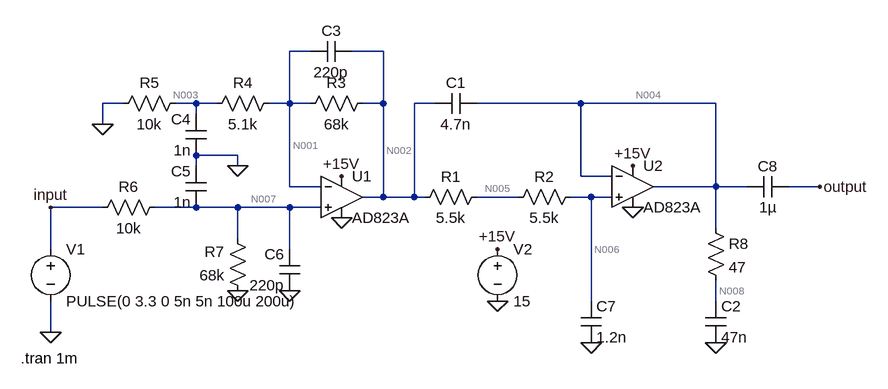
[diagram p0: schematic resolver.asc]
resolver.asc, the LTspice schematic file:
Version 4
SHEET 1 1056 680
WIRE 176 -80 144 -80
WIRE 288 -80 240 -80
WIRE -112 0 -144 0
WIRE 0 0 -32 0
WIRE 32 0 0 0
WIRE 144 0 144 -80
WIRE 144 0 112 0
WIRE 176 0 144 0
WIRE 288 0 288 -80
WIRE 288 0 256 0
WIRE 368 0 336 0
WIRE 592 0 432 0
WIRE 800 0 592 0
WIRE 0 16 0 0
WIRE -144 32 -144 0
WIRE 64 80 0 80
WIRE 0 96 0 80
WIRE 64 96 64 80
WIRE 592 112 592 0
WIRE 640 112 592 112
WIRE 144 128 144 0
WIRE 192 128 144 128
WIRE 800 128 800 0
WIRE 800 128 704 128
WIRE 848 128 800 128
WIRE 960 128 912 128
WIRE 288 144 288 0
WIRE 288 144 256 144
WIRE 336 144 336 0
WIRE 336 144 288 144
WIRE 352 144 336 144
WIRE 496 144 432 144
WIRE 608 144 576 144
WIRE 640 144 608 144
WIRE -144 160 -224 160
WIRE 0 160 -64 160
WIRE 64 160 0 160
WIRE 144 160 64 160
WIRE 192 160 144 160
WIRE 800 192 800 128
WIRE 64 208 64 160
WIRE -224 224 -224 160
WIRE 144 224 144 160
WIRE 608 304 608 144
WIRE 800 304 800 272
WIRE -224 352 -224 304
FLAG 64 288 0
FLAG 144 288 0
FLAG 608 368 0
FLAG 800 368 0
FLAG 64 96 0
FLAG -144 32 0
FLAG -224 352 0
FLAG 960 128 output
FLAG -224 160 input
FLAG 224 176 0
FLAG 672 160 0
FLAG 464 304 0
FLAG 464 224 +15V
FLAG 672 96 +15V
FLAG 224 112 +15V
SYMBOL OpAmps\\AD823A 224 80 R0
SYMATTR InstName U1
SYMBOL res 448 128 R90
WINDOW 0 0 56 VBottom 2
WINDOW 3 32 56 VTop 2
SYMATTR InstName R1
SYMATTR Value 5.5k
SYMBOL res 592 128 R90
WINDOW 0 0 56 VBottom 2
WINDOW 3 32 56 VTop 2
SYMATTR InstName R2
SYMATTR Value 5.5k
SYMBOL res 272 -16 R90
WINDOW 0 0 56 VBottom 2
WINDOW 3 32 56 VTop 2
SYMATTR InstName R3
SYMATTR Value 68k
SYMBOL res 128 -16 R90
WINDOW 0 0 56 VBottom 2
WINDOW 3 32 56 VTop 2
SYMATTR InstName R4
SYMATTR Value 5.1k
SYMBOL res -16 -16 R90
WINDOW 0 0 56 VBottom 2
WINDOW 3 32 56 VTop 2
SYMATTR InstName R5
SYMATTR Value 10k
SYMBOL res -48 144 R90
WINDOW 0 0 56 VBottom 2
WINDOW 3 32 56 VTop 2
SYMATTR InstName R6
SYMATTR Value 10k
SYMBOL res 80 304 R180
WINDOW 0 36 76 Left 2
WINDOW 3 36 40 Left 2
SYMATTR InstName R7
SYMATTR Value 68k
SYMBOL cap 432 -16 R90
WINDOW 0 0 32 VBottom 2
WINDOW 3 32 32 VTop 2
SYMATTR InstName C1
SYMATTR Value 4.7n
SYMBOL res 784 176 R0
SYMATTR InstName R8
SYMATTR Value 47
SYMBOL cap 784 304 R0
SYMATTR InstName C2
SYMATTR Value 47n
SYMBOL cap 240 -96 R90
WINDOW 0 0 32 VBottom 2
WINDOW 3 32 32 VTop 2
SYMATTR InstName C3
SYMATTR Value 220p
SYMBOL cap 16 80 R180
WINDOW 0 24 56 Left 2
WINDOW 3 24 8 Left 2
SYMATTR InstName C4
SYMATTR Value 1n
SYMBOL cap 16 160 R180
WINDOW 0 24 56 Left 2
WINDOW 3 24 8 Left 2
SYMATTR InstName C5
SYMATTR Value 1n
SYMBOL cap 160 288 R180
WINDOW 0 24 56 Left 2
WINDOW 3 24 8 Left 2
SYMATTR InstName C6
SYMATTR Value 220p
SYMBOL cap 592 304 R0
SYMATTR InstName C7
SYMATTR Value 1.2n
SYMBOL OpAmps\\AD823A 672 64 R0
SYMATTR InstName U2
SYMBOL cap 912 112 R90
WINDOW 0 0 32 VBottom 2
WINDOW 3 32 32 VTop 2
SYMATTR InstName C8
SYMATTR Value 1µ
SYMBOL voltage -224 208 R0
WINDOW 123 0 0 Left 0
WINDOW 39 0 0 Left 0
SYMATTR InstName V1
SYMATTR Value PULSE(0 3.3 0 5n 5n 100u 200u)
SYMBOL voltage 464 208 R0
WINDOW 123 0 0 Left 0
WINDOW 39 0 0 Left 0
SYMATTR InstName V2
SYMATTR Value 15
TEXT -270 392 Left 2 !.tran 1m

The netlist it stands for:
* resolver.asc
XU1 N007 N001 +15V 0 N002 AD823A  ; pins In+ In- V+ V- OUT
R1 N005 N002 5.5k
R2 N006 N005 5.5k
R3 N002 N001 68k
R4 N001 N003 5.1k
R5 N003 0 10k
R6 N007 input 10k
R7 0 N007 68k
C1 N004 N002 4.7n
R8 N004 N008 47
C2 N008 0 47n
C3 N002 N001 220p
C4 0 N003 1n
C5 N007 0 1n
C6 0 N007 220p
C7 N006 0 1.2n
XU2 N006 N004 +15V 0 N004 AD823A  ; pins In+ In- V+ V- OUT
C8 output N004 1µ
V1 input 0 PULSE(0 3.3 0 5n 5n 100u 200u)
V2 +15V 0 15
.tran 1m
.backanno
.end

* Results of the author's LTspice run, read from the files saved beside the schematic
* Operating Point, zero values left out:
*   V(+15v) = 15 V
*   V(n001) = 5.988 mV
*   V(n007) = 50.13 nV
*   V(n002) = 32.95 mV
*   V(n005) = 32.95 mV
*   V(n006) = 32.95 mV
*   V(n003) = 3.966 mV
*   V(n004) = 35.01 mV
*   V(n008) = 35.01 mV
*   V(output) = 35.01 nV
*   I(R6) = 5.013 pA
*   I(R5) = 396.6 nA
*   I(R4) = 396.6 nA
*   I(R3) = 396.6 nA
*   I(R2) = 5.747 pA
*   I(R1) = 5.747 pA
*   I(V2) = -6.66 mA
*   I(V1) = 5.013 pA
*   Ix(u1:1) = -5.75 pA
*   Ix(u1:2) = -5.749 pA
*   Ix(u1:3) = 3.33 mA
*   Ix(u1:4) = -3.33 mA
*   Ix(u1:5) = -396.6 nA
*   Ix(u2:1) = -5.747 pA
*   Ix(u2:2) = -5.746 pA
*   Ix(u2:3) = 3.33 mA
*   Ix(u2:4) = -3.33 mA
*   Ix(u2:5) = 5.746 pA
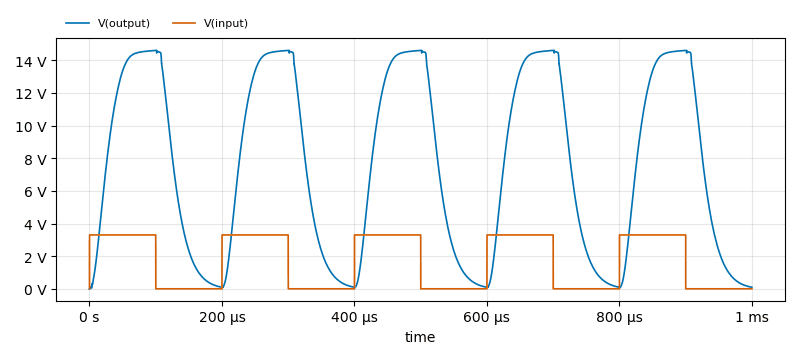
[diagram p1: Transient Analysis of resolver.asc, plotted from the saved traces]
* Transient Analysis, 1 run:
*   V(output): min 0 V, max 14.61 V, average 7.638 V, rms 9.556 V, last 95.38 mV
*   V(input): min 0 V, max 3.3 V, average 1.65 V, rms 2.333 V, last 0 V